# EasyEDA Pro project Smoke-purifier-Mini.eprj

# Schematic Smoke purifier Mini
Create Date: 2024-04-06; Page Name: P1; Project Name: Smoke-purifier-Mini; Schematic Name: Smoke purifier Mini; Update Date: 2024-06-26; Company: 嘉立创EDA; Drawed: Cameorn Bright; Page Size: A4; Reviewed: Cameorn Bright; Version: V1.0
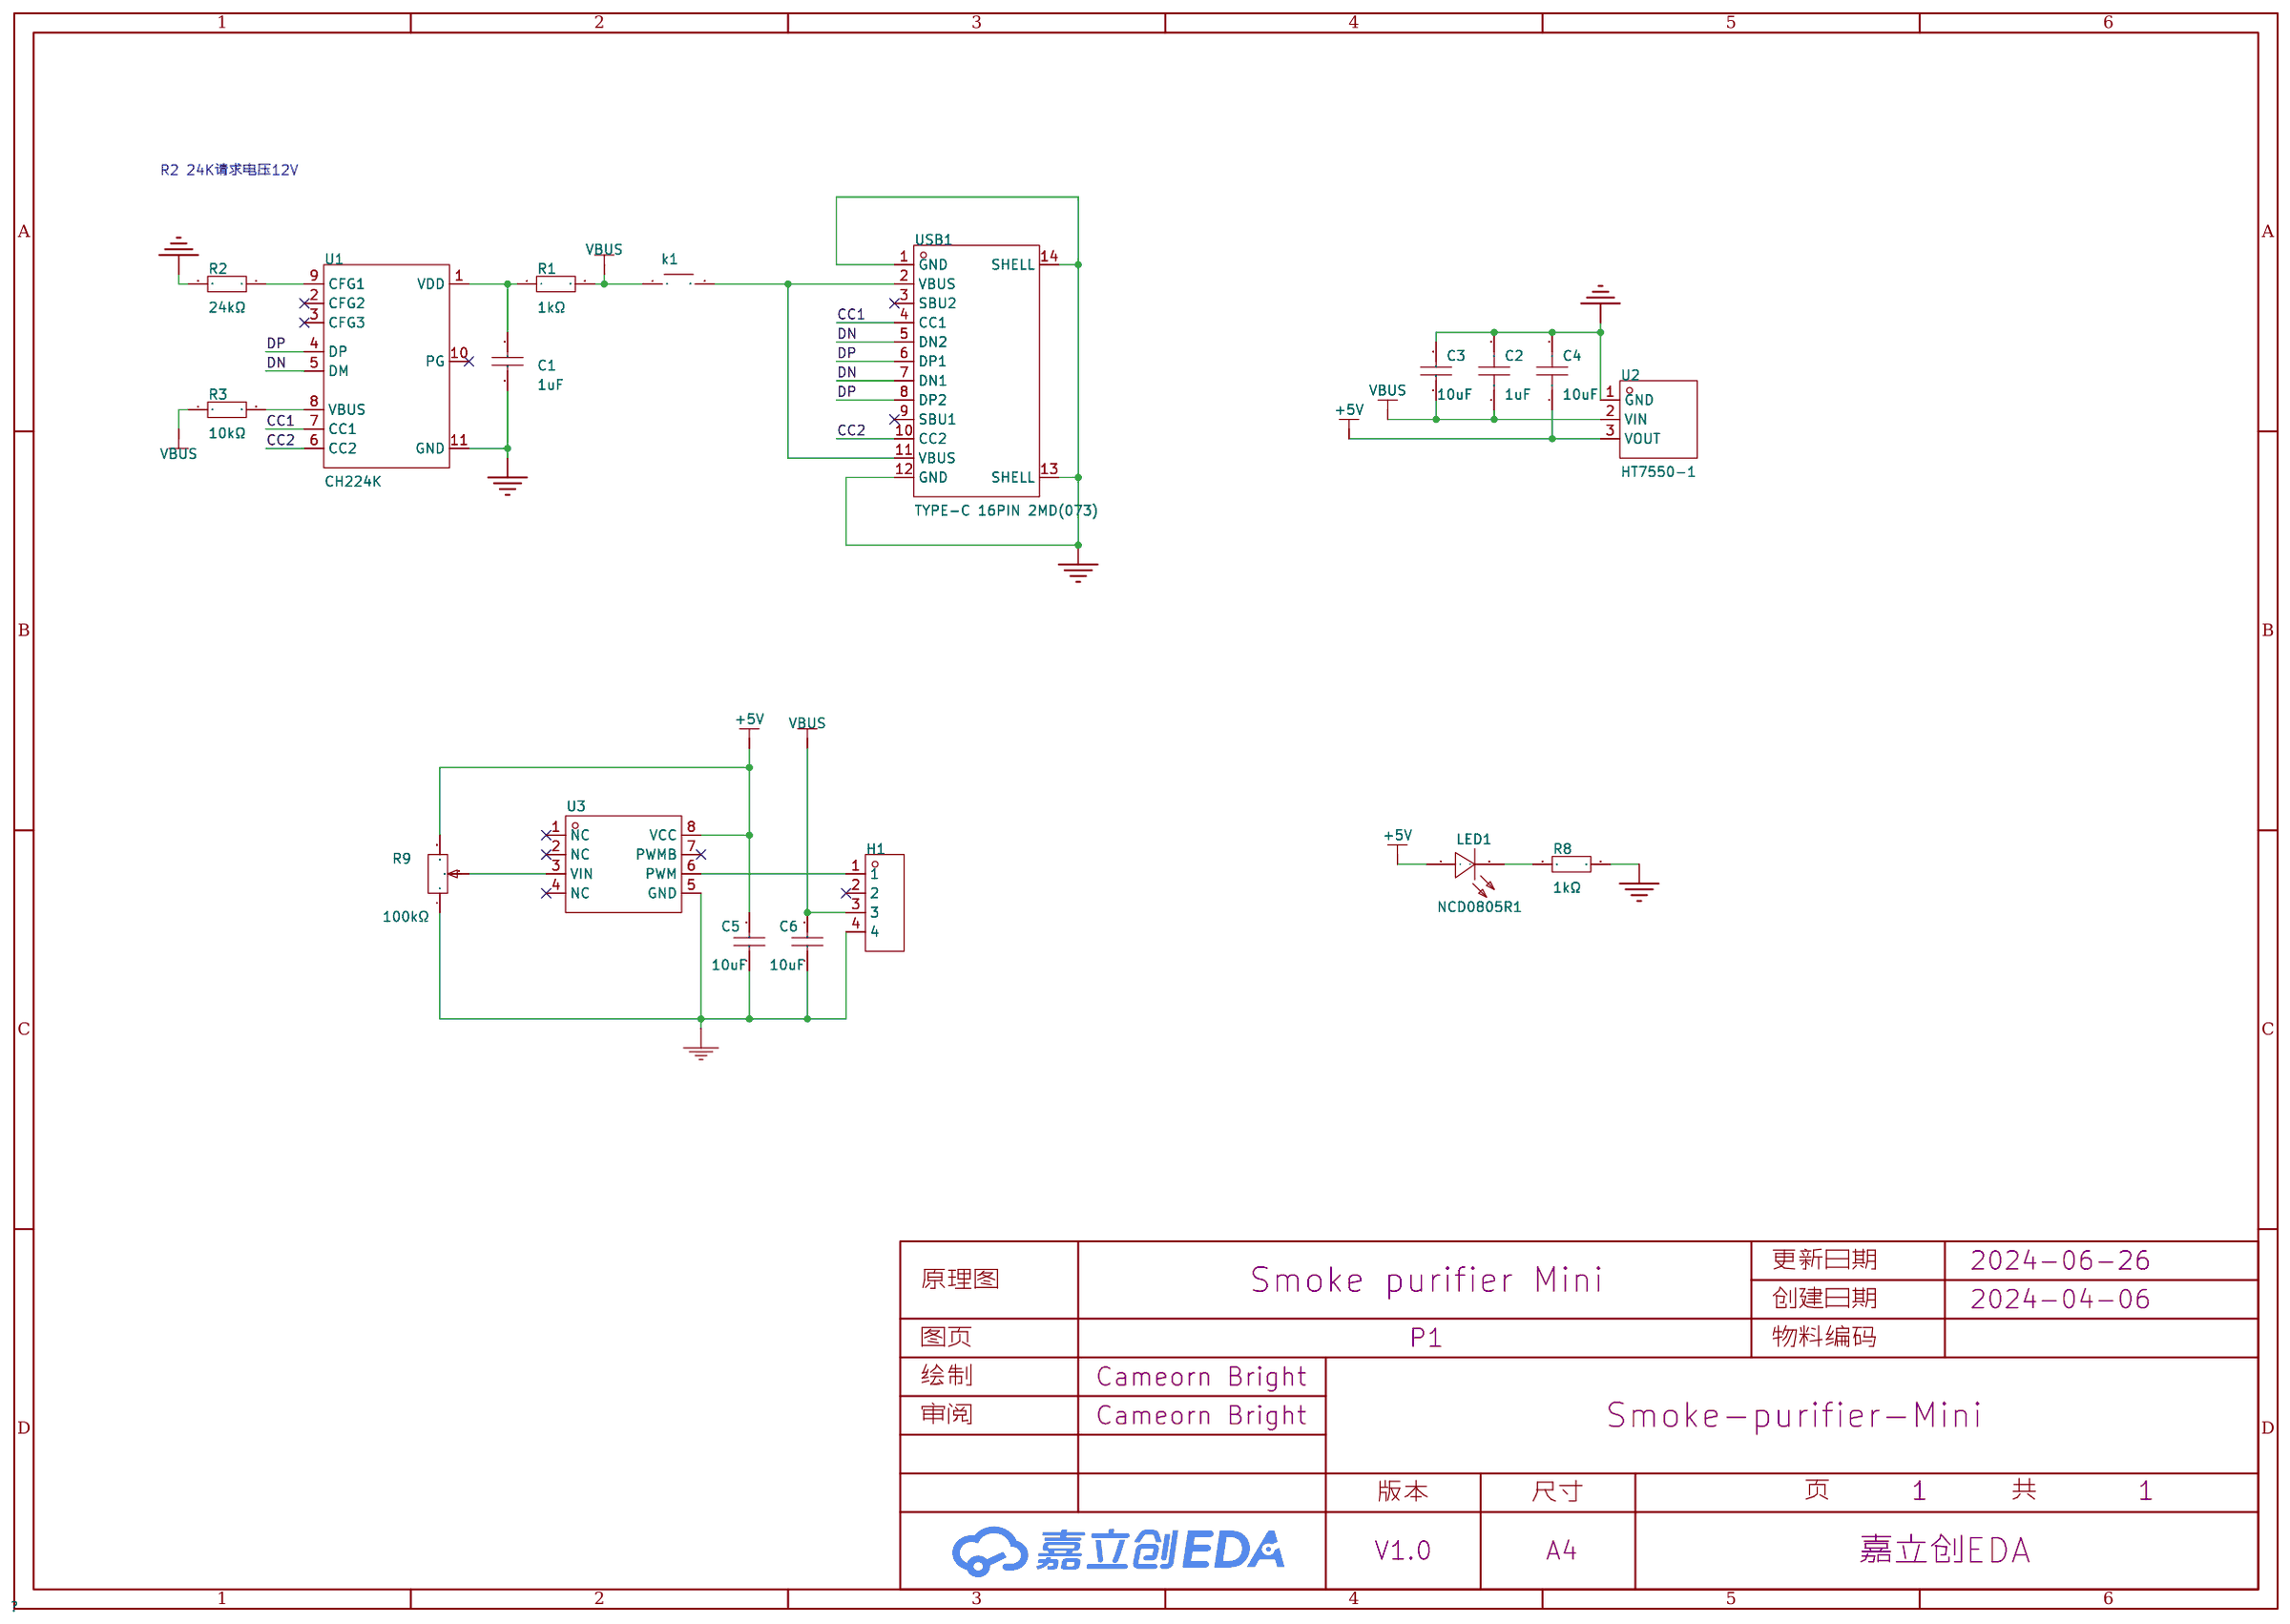
[diagram p0: schematic sheet]

## Parts
C1  1uF  [C0603]
C2  1uF  [C0603]
C3  10uF  [C0603]
C4  10uF  [C0603]
C5  10uF  [C0603]
C6  10uF  [C0603]
H1  -  [HDR-TH_4P-P2.54-V-F]
k1  -  [Key_mini]
LED1  NCD0805R1  [LED0603-RD_BLUE]
R1  1kΩ  [R0603]
R2  24kΩ  [R0603]
R3  10kΩ  [R0603]
R8  1kΩ  [R0603]
R9  100kΩ  [RES-ADJ-TH_R12-B503-3P]
U1  CH224K  [ESSOP-10_L4.9-W3.9-P1.0-LS6.0-TL-EP]
U2  HT7550-1  [SOT-89_L4.5-W2.5-P1.50-LS4.2-BR]
U3  GP9101-F20K-L2H1-SW  [SOP-8_L5.0-W3.9-P1.27-LS6.0-BL]
USB1  TYPE-C 16PIN 2MD(073)  [USB-C-SMD_TYPE-C-6PIN-2MD-073]

## Library data of the parts
C1 = CL10A105KB8NNNC: 容值:1uF;精度:±10%;额定电压:50V;材质(温度系数):X5R;; LCSC Part Name: 1uF ±10% 50V; Supplier Part: C15849; Manufacturer: SAMSUNG(三星); Supplier Footprint: 0603; JLCPCB Part Class: 基础库; Datasheet: https://atta.szlcsc.com/upload/public/pdf/source/20160218/1457707763339.pdf; Supplier: LCSC; Tolerance: ±10%; Voltage Rated: 50V; Temperature Coefficient: X5R
C2 C4 = GRM21BR61H106KE43L: 容值:10uF;精度:±10%;额定电压:50V;材质(温度系数):X5R;; LCSC Part Name: 10uF ±10% 50V; Supplier Part: C440198; Manufacturer: muRata(村田); Supplier Footprint: 0805; JLCPCB Part Class: 基础库; Datasheet: https://atta.szlcsc.com/upload/public/pdf/source/20230811/95AAE0C9AF55EDC31B7A4D8B733F534E.pdf; Supplier: LCSC; Tolerance: ±10%; Voltage Rated: 50V; Temperature Coefficient: X5R
C3 = CL21B105KBFNNNE: 容值:1uF;精度:±10%;额定电压:50V;材质(温度系数):X7R;; LCSC Part Name: 1uF ±10% 50V; Supplier Part: C28323; Manufacturer: SAMSUNG(三星); Supplier Footprint: 0805; JLCPCB Part Class: 基础库; Datasheet: https://atta.szlcsc.com/upload/public/pdf/source/20160218/1457707763339.pdf; Supplier: LCSC; Tolerance: ±10%; Voltage Rated: 50V; Temperature Coefficient: X7R
C5 C6 = GRM188R6YA106MA73D: 容值:10uF;精度:±20%;额定电压:35V;材质(温度系数):-;; LCSC Part Name: 10uF ±20% 35V; Supplier Part: C194427; Manufacturer: muRata(村田); Supplier Footprint: 0603; JLCPCB Part Class: Extended Part; Datasheet: https://atta.szlcsc.com/upload/public/pdf/source/20210128/C194427_FCA3640823207DDB58700A82F1A19B5F.pdf; Supplier: LCSC; Tolerance: ±20%; Voltage Rated: 35V
H1 = HDR-F_2.54_1x4P: Supplier Part: C2718488; Supplier Footprint: 插件
k1 = key1
LED1 = NCD0805R1: 灯头类型:-;发光颜色:红色;正向电压(VF):1.6V~2.6V;功率:65mW;正向电流:20mA;主波长:615nm~630nm;二极管配置:独立二极管;透镜颜色:无色透明透镜;色温:-;发光强度:67mcd~195mcd;发光角度:130°;载带方式:-;工作温度:-30℃~+85℃;; Supplier Part: C84256; Manufacturer: 国星光电; Supplier Footprint: 0805; JLCPCB Part Class: 基础库; Datasheet: https://atta.szlcsc.com/upload/public/pdf/source/20200820/C84256_F0A75A43B3EAD75808600A0514C76B99.pdf; Supplier: LCSC; Emitted Color: 红色; Forward Voltage (VF): 1.6V~2.6V; Power Dissipation: 65mW; Forward Current: 20mA; Dominant Wavelength: 615nm~630nm; Diode Configuration: 独立二极管; Lens Color: 无色透明透镜; Luminous Intensity: 67mcd~195mcd; Viewing Angle: 130°; Operating Temperature: -30℃~+85℃
R1 R8 = RC0603FR-071KL: 电阻类型:厚膜电阻;阻值:1kΩ;精度:±1%;功率:100mW;最大工作电压:75V;温度系数:±100ppm/℃;; LCSC Part Name: 厚膜电阻 1kΩ ±1% 100mW; Supplier Part: C22548; Manufacturer: YAGEO(国巨); Supplier Footprint: 0603; JLCPCB Part Class: 扩展库; Datasheet: https://atta.szlcsc.com/upload/public/pdf/source/20180316/70C0E2BDAE7FCC62C531A5A58D202EE1.pdf; Supplier: LCSC; Type: 厚膜电阻; Tolerance: ±1%; Power(Watts): 100mW; Overload Voltage (Max): 75V; Temperature Coefficient: ±100ppm/℃; Operating Temperature Range: -55℃~+155℃
R2 = 0603WAF2402T5E: 电阻类型:厚膜电阻;阻值:24kΩ;精度:±1%;功率:100mW;最大工作电压:75V;温度系数:±100ppm/℃;; LCSC Part Name: 24kΩ ±1% 100mW 厚膜电阻; Supplier Part: C23352; Manufacturer: UNI-ROYAL(厚声); Supplier Footprint: 0603; JLCPCB Part Class: 基础库; Datasheet: https://atta.szlcsc.com/upload/public/pdf/source/20200306/C422600_1E6D84923E4A46A82E41ADD87F860B5C.pdf; Supplier: LCSC; Type: 厚膜电阻; Tolerance: ±1%; Power(Watts): 100mW; Overload Voltage (Max): 75V; Temperature Coefficient: ±100ppm/℃; Operating Temperature Range: -55℃~+155℃
R3 = 0603WAF1002T5E: 电阻类型:厚膜电阻;阻值:10kΩ;精度:±1%;功率:100mW;最大工作电压:75V;温度系数:±100ppm/℃;; LCSC Part Name: 厚膜电阻 10kΩ ±1% 100mW; Supplier Part: C25804; Manufacturer: UNI-ROYAL(厚声); Supplier Footprint: 0603; JLCPCB Part Class: 基础库; Datasheet: https://atta.szlcsc.com/upload/public/pdf/source/20200306/C422600_1E6D84923E4A46A82E41ADD87F860B5C.pdf; Supplier: LCSC; Type: 厚膜电阻; Tolerance: ±1%; Power(Watts): 100mW; Overload Voltage (Max): 75V; Temperature Coefficient: ±100ppm/℃; Operating Temperature Range: -55℃~+155℃
R9 = 3296W-1-104LF: 阻值:100kΩ;精度:±10%;功率:500mW;温度系数:±100ppm/℃;; LCSC Part Name: 100kΩ ±10%; Supplier Part: C48084; Manufacturer: BOURNS; Supplier Footprint: 插件; JLCPCB Part Class: 扩展库; Datasheet: https://atta.szlcsc.com/upload/public/pdf/source/20151026/1457707506403.pdf; Supplier: LCSC; Tolerance: ±10%; Power(Watts): 500mW; Temperature Coefficient: ±100ppm/℃; Turns: 25
U1 = CH224K: 应用功能:USB充电芯片;; LCSC Part Name: USB PD等多快充协议受电芯片CH224; Supplier Part: C970725; Manufacturer: WCH(南京沁恒); Supplier Footprint: ESSOP-10-150mil-1mm; JLCPCB Part Class: 扩展库; Datasheet: https://atta.szlcsc.com/upload/public/pdf/source/20240313/43C2AFDDBDD1F65B60386D2CCAB0811B.pdf; Supplier: LCSC; Applications Function: USB充电芯片
U2 = HT7550-1_C347189: 输出类型:固定;最大输入电压:30V;输出电压:5V;最大输出电流:100mA;电源纹波抑制比(PSRR):-;输出极性:正极;; LCSC Part Name: 输入30V 输出5V 100mA; Supplier Part: C347189; Manufacturer: UMW(友台半导体); Supplier Footprint: SOT-89; JLCPCB Part Class: 扩展库; Datasheet: https://atta.szlcsc.com/upload/public/pdf/source/20231109/E587E38465720CDF1B9E4B203F8DC229.pdf; Supplier: LCSC; Output Type: 固定; Maximum Input Voltage: 30V; Output Voltage: 5V; MAX Output Current: 100mA; Dropout Voltage: 100mV@(1mA); standby current: 3uA; Operating Temperature: -25℃~+70℃; Output Polarity: 正极; Number of Outputs: 1
U3 = GP9101-F20K-L2H1-SW: GP9101 0-VCC转PWM 20KHz L2H1; LCSC Part Name: 模拟信号转PWM信号; Supplier Part: C2837710; Manufacturer: Guestgood(客益); Supplier Footprint: SOP8; JLCPCB Part Class: 扩展库; Datasheet: https://atta.szlcsc.com/upload/public/pdf/source/20210611/C2837710_B55E2012AD9BA99B0BFF632E52DE3359.pdf; Supplier: LCSC
USB1 = TYPE-C 16PIN 2MD(073): 连接器类型:Type-C;标准:-;公母:母;端口数量:1;触点数量:16P;安装方式:卧贴;额定电流 - 电源:5A;工作温度范围:-25℃~+85℃;; LCSC Part Name: Type-C 母 卧贴; Supplier Part: C2765186; Manufacturer: SHOU HAN(首韩); Supplier Footprint: SMD; JLCPCB Part Class: 扩展库; Datasheet: https://atta.szlcsc.com/upload/public/pdf/source/20211123/39B17C16241EAC15C5E277BDA434118E.pdf; Supplier: LCSC; Connector Type: Type-C; Gender: 母; Number of Ports: 1; Number of Contacts: 16P; Mounting Style: 卧贴; Current Rating - Power (Max): 5A; Operating Temperature Range: -25℃~+85℃

## Nets
+5V: C4.1 C5.2 LED1.1(+) R9.3 U2.3(VOUT) U3.8(VCC)
GND: C1.1 C2.2 C3.2 C4.2 C5.1 C6.1 H1.4 R2.2 R8.2 R9.1 U1.11(GND) U2.1(GND) U3.5(GND) USB1.1(GND) USB1.12(GND) USB1.13(SHELL) USB1.14(SHELL)
VBUS: C2.1 C3.1 C6.2 H1.3 k1.1 R1.2 R3.1 U2.2(VIN)
CC1: U1.7(CC1) USB1.4(CC1)
CC2: U1.6(CC2) USB1.10(CC2)
DN: U1.5(DM) USB1.5(DN2) USB1.7(DN1)
DP: U1.4(DP) USB1.6(DP1) USB1.8(DP2)
$1N732: C1.2 R1.1 U1.1(VDD)
$1N1065: R2.1 U1.9(CFG1)
$1N1176: R3.2 U1.8(VBUS)
$1N4275: H1.1 U3.6(PWM)
$1N4341: R9.2 U3.3(VIN)
$1N4543: LED1.2(-) R8.1
$1N10601: k1.2 USB1.2(VBUS) USB1.11(VBUS)

Not connected (* = marked no-connect by the designer): H1 2*; U1 2(CFG2)* 3(CFG3)* 10(PG)*; U3 1(NC)* 2(NC)* 4(NC)* 7(PWMB)*; USB1 3(SBU2)* 9(SBU1)*

## Notes on the sheet
- R2 24K请求电压12V

# Board PCB1
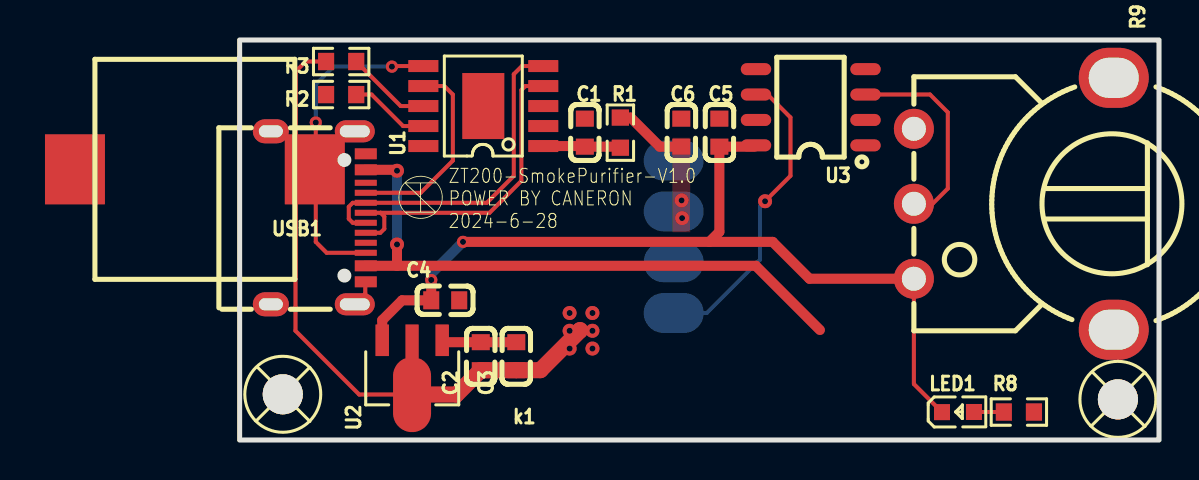
[diagram p1: board, top side]
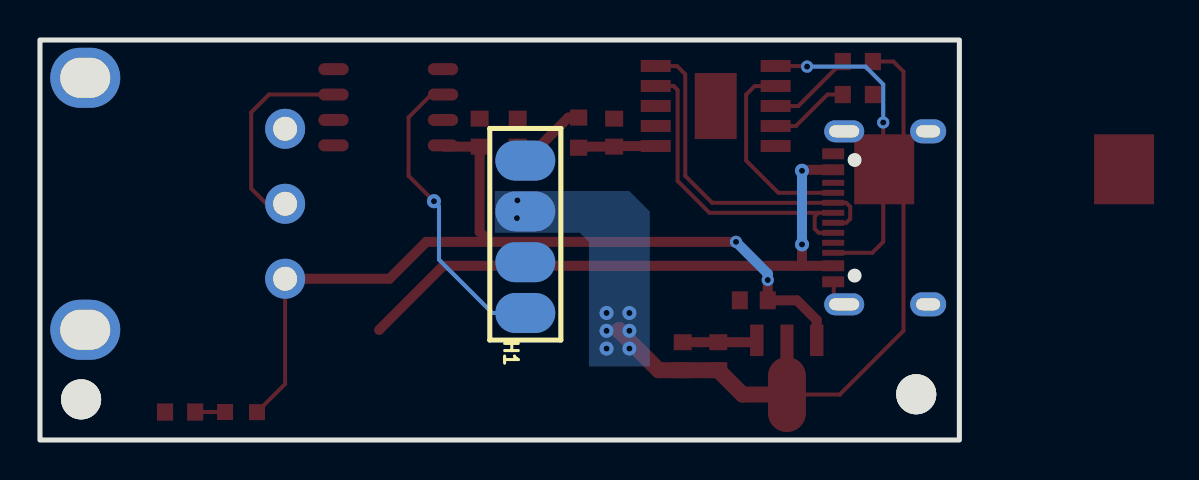
[diagram p2: board, bottom side, seen from below]

Outline 46 x 20 mm; copper layers: Top Layer, Bottom Layer. Coordinates in mm from the lower left corner of the outline.
Outline path: rectangle 0,20 46,0
Stack: Top Layer 0.035mm / Dielectric1 1.51mm FR4 er 4.5 / Bottom Layer 0.035mm

## Design rules (mm)
net DN: DP1
net DP: DP1
template: 自定义配置
spacing copperThickness1oz (default): track to track 0.102, other pairs 0.1 to 0.3
spacing copperThickness2oz: track to track 0.203, other pairs 0.152 to 0.3
track width copperThickness1oz (default): min 0.127, default 0.254, max 2.54
track width copperThickness2oz: min 0.203, default 0.254, max 2.54
differential pair differentialPair (default): width min 0.127, default 0.254, max 5; gap min 0.152, default 0.152
via viaSize (default): diameter min 0.5, default 0.61, max 10; hole min 0.3, default 0.305, max 6.3

## Placement (name value [footprint] x y rotation side)
C1  1uF  [C0603]  17.27 15.37 270 top
C2  1uF  [C0603]  12.06 4.19 90 top
C3  10uF  [C0603]  13.84 4.19 90 top
C4  10uF  [C0603]  10.29 6.98 0 top
C5  10uF  [C0603]  24 15.37 270 top
C6  10uF  [C0603]  22.1 15.37 270 top
H1  -  [hdr-th_4p-p2.54-v-f]  21.72 10.29 90 bottom
k1  -  [Key_mini]  18.03 0 0 top
LED1  NCD0805R1  [LED0603-RD_BLUE]  35.94 1.4 0 top
R1  1kΩ  [R0603]  19.05 15.37 90 top
R2  24kΩ  [R0603]  5.08 17.27 180 top
R3  10kΩ  [R0603]  5.08 18.92 0 top
R8  1kΩ  [R0603]  38.99 1.4 0 top
R9  100kΩ  [RES-ADJ-TH_R12-B503-3P]  38.74 11.81 270 top
SCREW1  -  [M2螺丝]  2.16 2.29 0 top
SCREW2  -  [M2螺丝]  43.94 2.03 0 top
U1  CH224K  [ESSOP-10_L4.9-W3.9-P1.0-LS6.0-TL-EP]  12.19 16.7 90 top
U2  HT7550-1  [SOT-89_L4.5-W2.5-P1.50-LS4.2-BR]  8.64 3.63 90 top
U3  GP9101-F20K-L2H1-SW  [SOP-8_L5.0-W3.9-P1.27-LS6.0-BL]  28.57 16.64 90 top
USB1  TYPE-C 16PIN 2MD(073)  [USB-C-SMD_TYPE-C-6PIN-2MD-073]  3.94 11.11 270 top

## Footprints (pads in the part's own frame, mm; a bottom-side part is the same pattern mirrored in y, then rotated)
C0603
  rect 0.8x0.9 smd: 1(-0.7,0) 2(0.7,0)
ESSOP-10_L4.9-W3.9-P1.0-LS6.0-TL-EP
  rect 0.6x1.5 smd: 1(-2,-3) 2(-1,-3) 3(0,-3) 4(1,-3) 5(2,-3) 6(2,3) 7(1,3) 8(0,3) 9(-1,3) 10(-2,3)
  rect 3.3x2.1 smd: 11(0,0)
hdr-th_4p-p2.54-v-f
  oval 2x3 smd: 1(-3.937,0) 2(-1.397,0) 3(1.143,0) 4(3.683,0)
Key_mini
  rect 3x3.5 smd: 1(-26.273,13.534) 2(-14.273,13.534)
LED0603-RD_BLUE
  rect 0.8x0.8 smd: 1(-0.799,-0.004) 2(0.799,0.004)
M2螺丝
  round 2 hole 2: 1(0,0)
R0603
  rect 0.806x0.864 smd: 1(-0.753,0) 2(0.753,0)
RES-ADJ-TH_R12-B503-3P
  round 2 hole 1.2: 1(-3.749,-5) 2(0,-5) 3(3.749,-5)
  oval 3x3.5 hole 2x2.5: 4(6.299,5) 5(-6.299,5)
SOP-8_L5.0-W3.9-P1.27-LS6.0-BL
  oval 0.6x1.52 smd: 1(-1.905,-2.74) 2(-0.635,-2.74) 3(0.635,-2.74) 4(1.905,-2.74) 5(1.905,2.74) 6(0.635,2.74) 7(-0.635,2.74) 8(-1.905,2.74)
SOT-89_L4.5-W2.5-P1.50-LS4.2-BR
  rect 1.575x0.672 smd: 1(1.356,-1.5) 3(1.356,1.5)
  custom 5.377x1.9 smd: 2(-1.356,0.009)
USB-C-SMD_TYPE-C-6PIN-2MD-073
  rect 0.55x1.1 smd: 1(-3.2,2.375) 2(-2.4,2.375) 11(2.4,2.375) 12(3.2,2.375)
  rect 0.3x1.1 smd: 3(-1.75,2.375) 4(-1.25,2.375) 5(-0.75,2.375) 6(-0.25,2.375) 7(0.25,2.375) 8(0.75,2.375) 9(1.25,2.375) 10(1.75,2.375)
  oval 1.1x2 hole 0.6x1.5: 13(-4.325,1.825) 14(4.325,1.825)
  oval 1.2x1.8 hole 0.6x1.2: 13(-4.325,-2.375) 14(4.325,-2.375)

## Nets
As in the schematic.

Pads without a net: H1 2; R9 4 5; SCREW1 1; SCREW2 1; U1 2 3 10; U3 1 2 4 7; USB1 3 9

## Via types
v1: diameter 0.61, hole 0.305, Top Layer to Bottom Layer, 4 vias
v2: diameter 0.7, hole 0.305, Top Layer to Bottom Layer, 8 vias
v3: diameter 0.7, hole 0.3, Top Layer to Bottom Layer, 3 vias

## Routing (per net, layer and track width the routed paths; a pad name or vN(x,y) marks a point on that pad's centre or on a via; arc(x,y) is an arc through that point)
+5V: length 44.9
  Top Layer w0.2: LED1.1 33.74,2.8 R9.3 ; 25.77,14.67 25.84,14.73
  Top Layer w0.5: 25.77,14.67 C5.2 24,10.41 23.5,9.91 ; v1(11.18,9.91) 23.5,9.91 ; 23.5,9.91 26.67,9.91 28.51,8.06 R9.3 ; U2.3 7.14,5.99 8.13,6.98 C4.1 v1(9.59,8)
  Bottom Layer w0.5: v1(9.59,8) 9.59,8.32 v1(11.18,9.91)
GND: length 5.1
  Top Layer w0.2: 5.77,6.8 6.29,7.33 6.29,7.94
  Top Layer w0.5: C3.2 C2.2 10.23,4.89 U2.1
VBUS: length 35.3
  Top Layer w0.2: U2.2 5.98,2.27 2.79,5.46 2.79,18.42 3.3,18.92 R3.1
  Top Layer w0.5: C6.2 21.02,14.67 19.57,16.12 R1.2
  Top Layer w0.8: 17.03,5.5 17.02,5.48 17.02,5.46 15.05,3.49 C3.1 C2.1 10.85,2.27 U2.2
  vias: v2(16.51,6.35) v2(16.51,5.46) v2(16.51,4.57) v2(17.65,6.35) v2(17.65,5.46) v2(17.65,4.57) v3(22.11,11.98) v3(22.14,11.09)
CC1: length 10
  Top Layer w0.2: USB1.4 9.06,12.36 10.67,13.97 10.67,17.27 10.24,17.7 U1.7
CC2: length 16.4
  Top Layer w0.2: U1.6 7.65,18.7 v1(7.62,18.67) ; USB1.10 4.36,9.36 3.81,9.91 v1(3.81,15.88)
  Bottom Layer w0.2: v1(7.62,18.67) 4.7,18.67 3.81,17.78 v1(3.81,15.88)
DN: length 17.2
  Top Layer w0.2: USB1.7 5.66,10.86 5.46,11.06 5.46,11.66 5.66,11.86 USB1.5 12.37,11.86 13.72,13.21 13.72,18.29 14.13,18.7 U1.5
DP: length 16.1
  Top Layer w0.2: USB1.8 7.04,10.36 7.24,10.56 7.24,11.18 7.06,11.36 ; 7.06,11.36 USB1.6 ; 7.06,11.36 12.5,11.36 14.1,12.95 14.1,17.5 14.3,17.7 U1.4
$1N732: length 3.9
  Top Layer w0.5: U1.1 17.24,14.7 C1.2 19,14.67 R1.1
$1N1065: length 4
  Top Layer w0.2: R2.1 6.6,17.27 8.18,15.7 U1.9
$1N1176: length 4.3
  Top Layer w0.2: U1.8 8.06,16.7 R3.2
$1N4275: length 15.4
  Top Layer w0.2: v3(26.29,11.94) 27.56,13.21 27.56,16.13 26.42,17.27 25.84,17.27
  Bottom Layer w0.2: H1.1 23.37,6.35 26.03,9.02 26.03,11.68 v3(26.29,11.94)
$1N4341: length 10.3
  Top Layer w0.2: U3.3 34.54,17.27 35.43,16.38 35.43,12.57 34.67,11.81 R9.2
$1N4543: length 1.5
  Top Layer w0.2: R8.1 38.23,1.4 LED1.2
$1N10601: length 30.4
  Top Layer w0.5: v2(7.87,9.78) 7.87,8.71 ; 7.87,8.71 25.82,8.71 29.03,5.5 ; 7.87,8.71 USB1.11 ; v2(7.87,13.46) 7.83,13.51 USB1.2
  Bottom Layer w0.5: v2(7.87,9.78) v2(7.87,13.46)

## Copper pours and planes (outline as drawn; the poured copper is in the pictures)
GND on Top Layer: -2.79,21.84 50.16,21.84 50.16,-2.03 -2.79,-2.03
GND on Bottom Layer: -2.79,21.84 50.16,21.84 50.16,-2.03 -2.79,-2.03
VBUS on Top Layer: 21.65,15.08 22.55,15.08 22.55,10.39 21.65,10.39
VBUS on Bottom Layer: 15.49,12.45 23.24,12.45 23.24,3.68 15.49,3.68

Small or netless copper shapes (teardrops, artwork), in the pictures only: 2 on Top Layer

## Text on the board
Top Silkscreen Layer: ZT200-SmokePurifier-V1.0 / POWER BY CANERON / 2024-6-28
